# EAGLE design devboard (EAGLE 6.4)
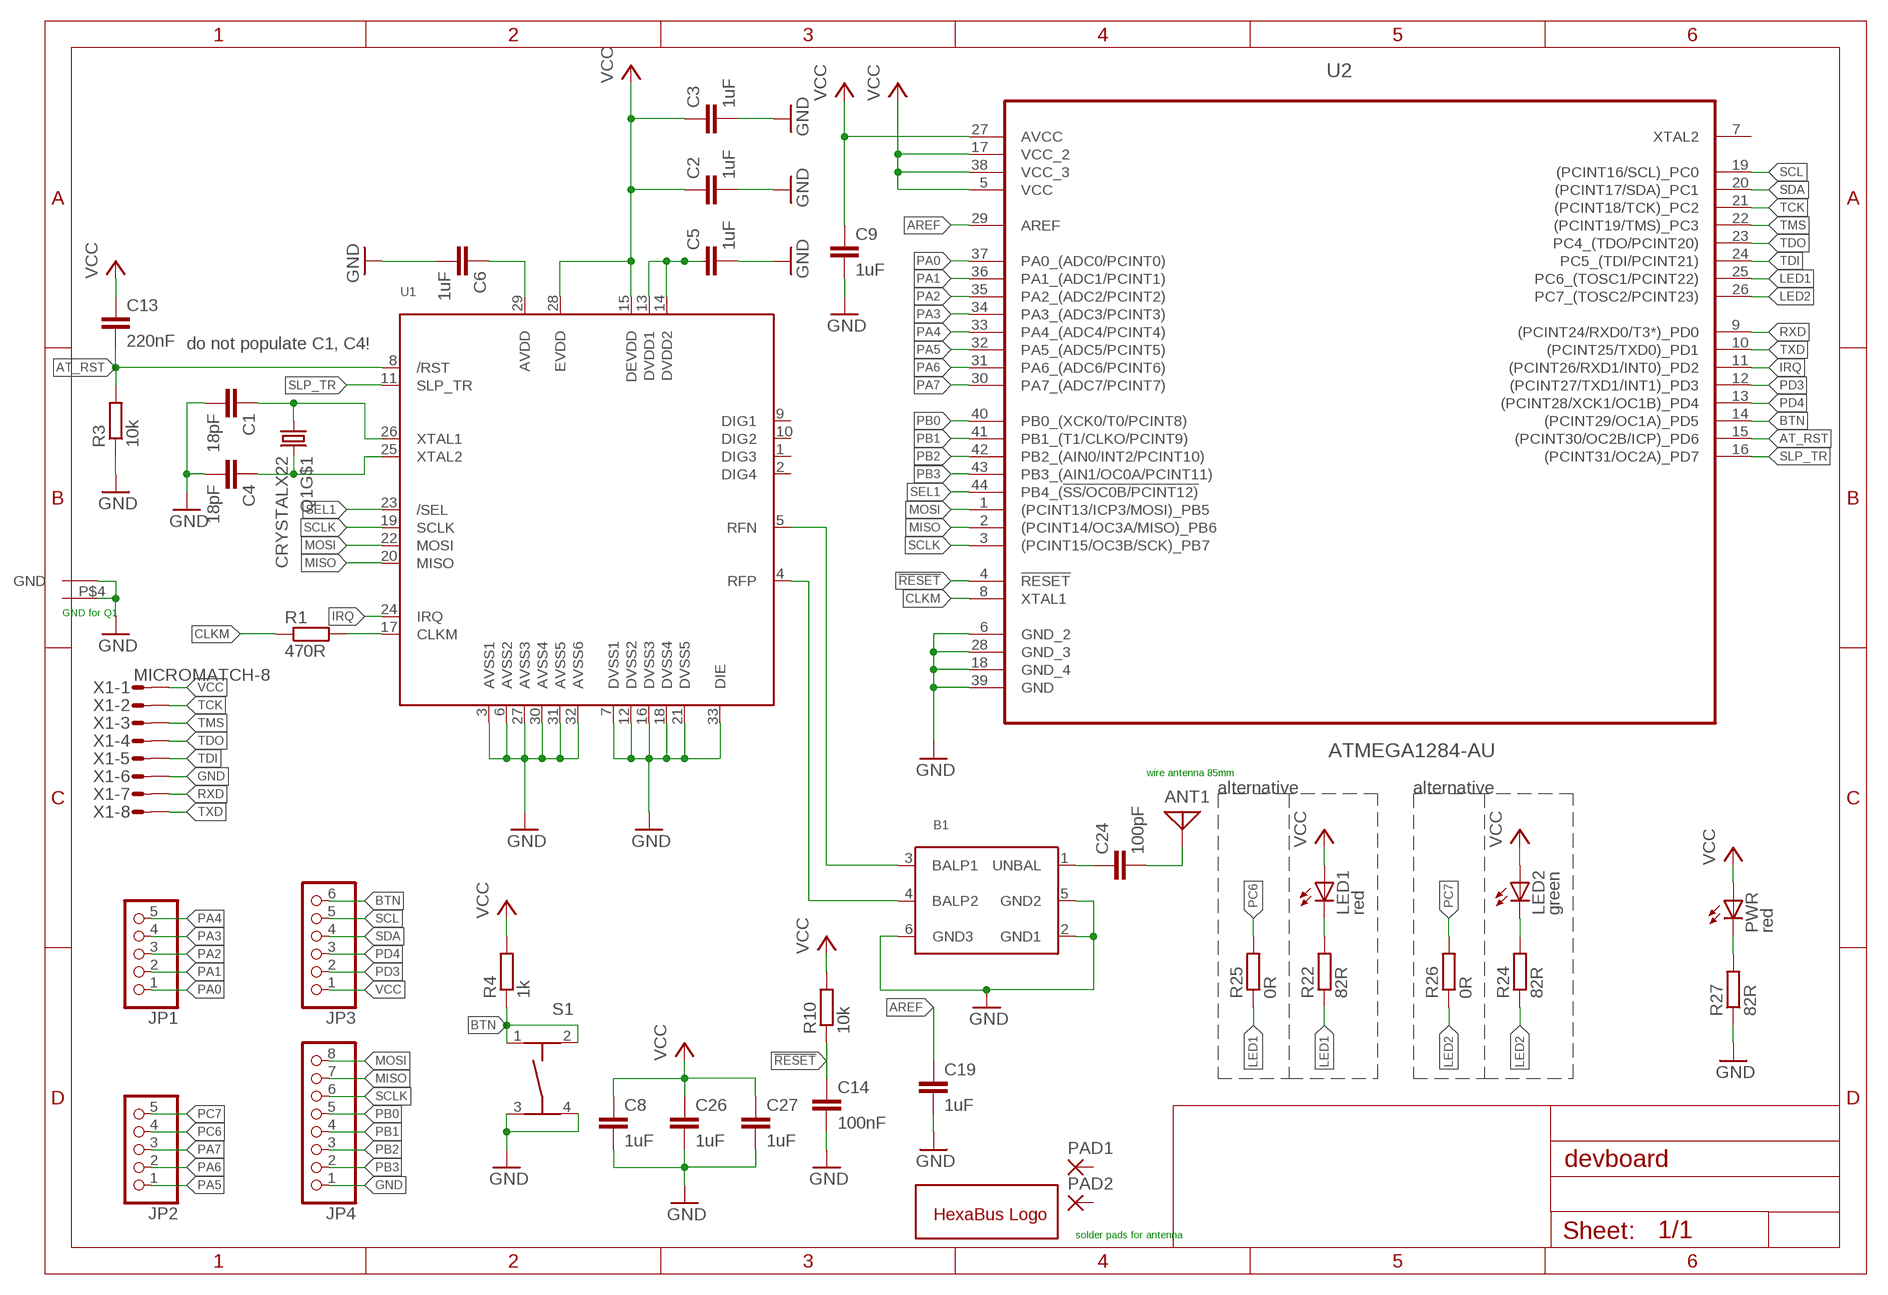
[diagram p0: schematic, sheet 1]

## Parts
ANT1  ANTENNA  [PAD-01]
B1  BALUN+LP  [BALUN0805]
C1  18pF  C-EUC0603  [C0603]
C2  1uF  C-EUC0603  [C0603]
C3  1uF  C-EUC0603  [C0603]
C4  18pF  C-EUC0603  [C0603]
C5  1uF  C-EUC0603  [C0603]
C6  1uF  C-EUC0603  [C0603]
C8  1uF  C-EUC0603  [C0603]
C9  1uF  C-EUC0603  [C0603]
C13  220nF  C-EUC0603  [C0603]
C14  100nF  C-EUC0603  [C0603]
C19  1uF  C-EUC0603  [C0603]
C24  100pF  C-EUC0603  [C0603]
C26  1uF  C-EUC0603  [C0603]
C27  1uF  C-EUC0603  [C0603]
JP1  PINHD-1X5  [1X05]
JP2  PINHD-1X5  [1X05]
JP3  PINHD-1X6  [1X06]
JP4  PINHD-1X8  [1X08]
LED1  red  LEDCHIP-LED0603  [CHIP-LED0603]
LED2  green  LEDCHIP-LED0603  [CHIP-LED0603]
PAD1  SMD2  [SMD1,27-2,54]
PAD2  SMD2  [SMD1,27-2,54]
PWR  red  LEDCHIP-LED0603  [CHIP-LED0603]
Q1  CRYSTALX22  [X22]
R1  470R  R-EU_R0603  [R0603]
R3  10k  R-EU_R0603  [R0603]
R4  1k  R-EU_R0603  [R0603]
R10  10k  R-EU_R0603  [R0603]
R22  82R  R-EU_R0603  [R0603]
R24  82R  R-EU_R0603  [R0603]
R25  0R  R-EU_R0603  [R0603]
R26  0R  R-EU_R0603  [R0603]
R27  82R  R-EU_R0603  [R0603]
S1  TASTER-9314_SMD  [TASTER-9314_SMD]
U1  AT86RF212  [32QN2]
U2  ATMEGA1284-AU  [QFP80P1200X1200X120-44N]
U$1  HEXAKRAKE  [HEXAKRAKE]
X1  MICROMATCH-8  [MICROMATCH-8]

## Nets
!RESET: C14.1 R10.1 U2.4(!RESET)
AREF: C19.1 U2.29(AREF)
AT_RST: C13.2 R3.2 U1.8(/RST) U2.15((PCINT30/OC2B/ICP)_PD6)
BTN: JP3.6 R4.1 S1.1 S1.2 U2.14((PCINT29/OC1A)_PD5)
CLKM: R1.1 U2.8(XTAL1)
GND: B1.2(GND1) B1.5(GND2) B1.6(GND3) C1.2 C2.2 C3.2 C4.2 C5.2 C6.2 C8.2 C9.2 C14.2 C19.2 C26.2 C27.2 JP4.1 Q1.P$2(GND) Q1.P$4(GND1) R3.1 R27.1 S1.3 S1.4 U1.3(AVSS1) U1.6(AVSS2) U1.7(DVSS1) U1.12(DVSS2) U1.16(DVSS3) U1.18(DVSS4) U1.21(DVSS5) U1.27(AVSS3) U1.30(AVSS4) U1.31(AVSS5) U1.32(AVSS6) U1.33(DIE) U2.6(GND_2) U2.18(GND_4) U2.28(GND_3) U2.39(GND) X1.6
IRQ: U1.24(IRQ) U2.11((PCINT26/RXD1/INT0)_PD2)
LED1: R22.1 R25.1 U2.25(PC6_(TOSC1/PCINT22))
LED2: R24.1 R26.1 U2.26(PC7_(TOSC2/PCINT23))
MISO: JP4.7 U1.20(MISO) U2.2((PCINT14/OC3A/MISO)_PB6)
MOSI: JP4.8 U1.22(MOSI) U2.1((PCINT13/ICP3/MOSI)_PB5)
N$1: C6.1 U1.29(AVDD)
N$2: C5.1 U1.13(DVDD1) U1.14(DVDD2)
N$4: LED1.C R22.2
N$5: R1.2 U1.17(CLKM)
N$13: LED2.C R24.2
N$28: B1.3(BALP1) U1.5(RFN)
N$29: B1.4(BALP2) U1.4(RFP)
N$30: C1.1 Q1.P$1 U1.26(XTAL1)
N$31: C4.1 Q1.P$3 U1.25(XTAL2)
N$32: PWR.C R27.2
N$33: B1.1(UNBAL) C24.1
N$34: ANT1.1 C24.2
PA0: JP1.1 U2.37(PA0_(ADC0/PCINT0))
PA1: JP1.2 U2.36(PA1_(ADC1/PCINT1))
PA2: JP1.3 U2.35(PA2_(ADC2/PCINT2))
PA3: JP1.4 U2.34(PA3_(ADC3/PCINT3))
PA4: JP1.5 U2.33(PA4_(ADC4/PCINT4))
PA5: JP2.1 U2.32(PA5_(ADC5/PCINT5))
PA6: JP2.2 U2.31(PA6_(ADC6/PCINT6))
PA7: JP2.3 U2.30(PA7_(ADC7/PCINT7))
PB0: JP4.5 U2.40(PB0_(XCK0/T0/PCINT8))
PB1: JP4.4 U2.41(PB1_(T1/CLKO/PCINT9))
PB2: JP4.3 U2.42(PB2_(AIN0/INT2/PCINT10))
PB3: JP4.2 U2.43(PB3_(AIN1/OC0A/PCINT11))
PC6: JP2.4 R25.2
PC7: JP2.5 R26.2
PD3: JP3.2 U2.12((PCINT27/TXD1/INT1)_PD3)
PD4: JP3.3 U2.13((PCINT28/XCK1/OC1B)_PD4)
RXD: U2.9((PCINT24/RXD0/T3*)_PD0) X1.7
SCL: JP3.5 U2.19((PCINT16/SCL)_PC0)
SCLK: JP4.6 U1.19(SCLK) U2.3((PCINT15/OC3B/SCK)_PB7)
SDA: JP3.4 U2.20((PCINT17/SDA)_PC1)
SEL1: U1.23(/SEL) U2.44(PB4_(!SS/OC0B/PCINT12))
SLP_TR: U1.11(SLP_TR) U2.16((PCINT31/OC2A)_PD7)
TCK: U2.21((PCINT18/TCK)_PC2) X1.2
TDI: U2.24(PC5_(TDI/PCINT21)) X1.5
TDO: U2.23(PC4_(TDO/PCINT20)) X1.4
TMS: U2.22((PCINT19/TMS)_PC3) X1.3
TXD: U2.10((PCINT25/TXD0)_PD1) X1.8
VCC: C2.1 C3.1 C8.1 C9.1 C13.1 C26.1 C27.1 JP3.1 LED1.A LED2.A PWR.A R4.2 R10.2 U1.15(DEVDD) U1.28(EVDD) U2.5(VCC) U2.17(VCC_2) U2.27(AVCC) U2.38(VCC_3) X1.1
Unconnected: PAD1.1(P) PAD2.1(P) U1.1(DIG3) U1.2(DIG4) U1.9(DIG1) U1.10(DIG2) U2.7(XTAL2)

## Notes on the sheet
- do not populate C1, C4!
- GND for Q1
- wire antenna 85mm
- alternative | alternative
- solder pads for antenna

## Library data of the parts
ANT1 = discrete:ANTENNA: Antenna
B1 = microbuilder:BALUN+LP: Balun + Low Pass Filter 0805 863-928 MHz Balun + Low Pass Filter (0805) - Digikey: 712-1473-1-ND
C1-C6 C8 C9 C13 C14 C19 C24 C26 C27 = rcl:C-EU: CAPACITOR, European symbol
JP1 JP2 = pinhead:PINHD-1X5: PIN HEADER
JP3 = pinhead:PINHD-1X6: PIN HEADER
JP4 = pinhead:PINHD-1X8: PIN HEADER
LED1 LED2 PWR = led:LED: LED OSRAM: - CHIPLED LG R971, LG N971, LY N971, LG Q971, LY Q971, LO R971, LY R971 LH N974, LH R974 LS Q976, LO Q976, LY Q976 LO Q996 - Hyper CHIPLED LW Q18S LB Q993, LB Q99A, LB R99A - SideLED LS A670, LO A670, LY A670, LG A670, LP A670 LB A673, LV A673, LT A673, LW A673 LH A674 LY A675 LS A676, LA A676, LO A676, LY A676, LW A676 LS A679, LY A679, LG A679 - Hyper Micro SIDELED® LS Y876, LA Y876, LO Y876, LY Y876 LT Y87S - SmartLED LW L88C, LW L88S LB L89C, LB L89S, LG L890 LS L89K, LO L89K, LY L89K LS L896, LA L896, LO L896, LY L896 - TOPLED LS T670, LO T670, LY T670, LG T670, LP T670 LSG T670, LSP T670, LSY T670, LOP T670, LYG T670 LG T671, LOG T671, LSG T671 LB T673, LV T673, LT T673, LW T673 LH T674 LS T676, LA T676, LO T676, LY T676, LB T676, LH T676, LSB T676, LW T676 LB T67C, LV T67C, LT T67C, LS T67K, LO T67K, LY T67K, LW E67C LS E67B, LA E67B, LO E67B, LY E67B, LB E67C, LV E67C, LT E67C LW T67C LS T679, LY T679, LG T679 LS T770, LO T770, LY T770, LG T770, LP T770 LB T773, LV T773, LT T773, LW T773 LH T774 LS E675, LA E675, LY E675, LS T675 LS T776, LA T776, LO T776, LY T776, LB T776 LHGB T686 LT T68C, LB T68C - Hyper Mini TOPLED® LB M676 - Mini TOPLED Santana® LG M470 LS M47K, LO M47K, LY M47K Source: http://www.osram.convergy.de LUXEON: - LUMILED® LXK2-PW12-R00, LXK2-PW12-S00, LXK2-PW14-U00, LXK2-PW14-V00 LXK2-PM12-R00, LXK2-PM12-S00, LXK2-PM14-U00 LXK2-PE12-Q00, LXK2-PE12-R00, LXK2-PE12-S00, LXK2-PE14-T00, LXK2-PE14-U00 LXK2-PB12-K00, LXK2-PB12-L00, LXK2-PB12-M00, LXK2-PB14-N00, LXK2-PB14-P00, LXK2-PB14-Q00 LXK2-PR12-L00, LXK2-PR12-M00, LXK2-PR14-Q00, LXK2-PR14-R00 LXK2-PD12-Q00, LXK2-PD12-R00, LXK2-PD12-S00 LXK2-PH12-R00, LXK2-PH12-S00 LXK2-PL12-P00, LXK2-PL12-Q00, LXK2-PL12-R00 Source: www.luxeon.com KINGBRIGHT: KA-3528ASYC Source: www.kingbright.com
PAD1 PAD2 = wirepad:SMD2: SMD PAD
Q1 = crystals-new:CRYSTAL
R1 R3 R4 R10 R22 R24-R27 = rcl:R-EU_: RESISTOR, European symbol
S1 = Ergaenzung:TASTER-9314_SMD
U1 = microbuilder:AT86RF212: AT86RF212 - Low-Power SPI-based 700/800/900 MHz Transceiver Digikey: AT86RF212-ZU-ND
U2 = hexabus:ATMEGA1284-AU: MCU, 8BIT, AVR, 128K FLASH, TQFP-44; MPN: ATMEGA1284-AU; OC_FARNELL: 1972064; OC_NEWARK: 68T2551; PACKAGE: TQFP-44; SUPPLIER: ATMEL
U$1 = artwork:HEXAKRAKE
X1 = con-amp-micromatch:MICROMATCH-8: MicroMaTch 8 7-215464-8 / 0-215464-8 Drawing Number C-215464 DDEController.pdf; MF: FARNELL; MPN: 7-215464-8; OC_FARNELL: 3784642; OC_NEWARK: 26H0301

## Board
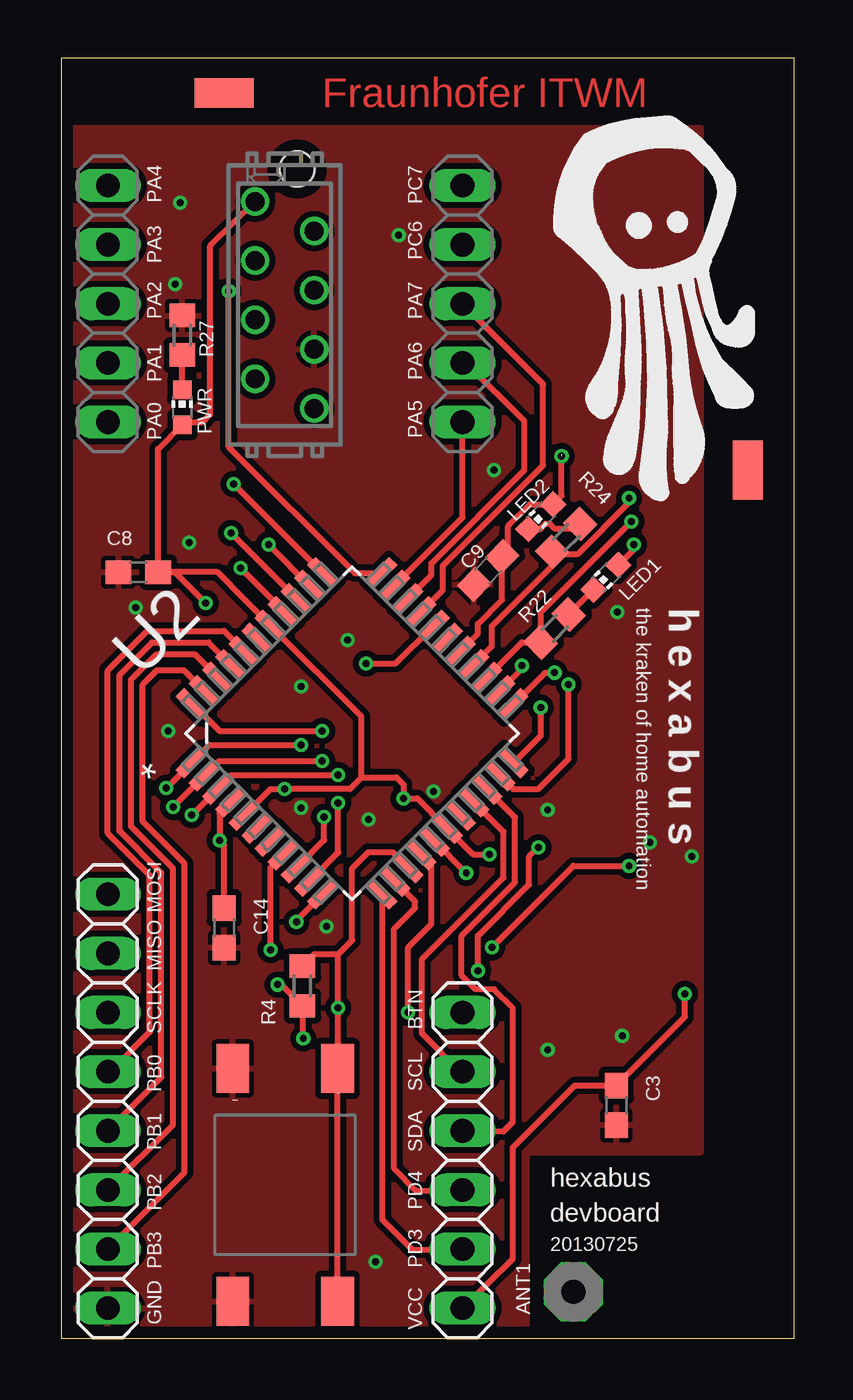
[diagram p1: board, top side]
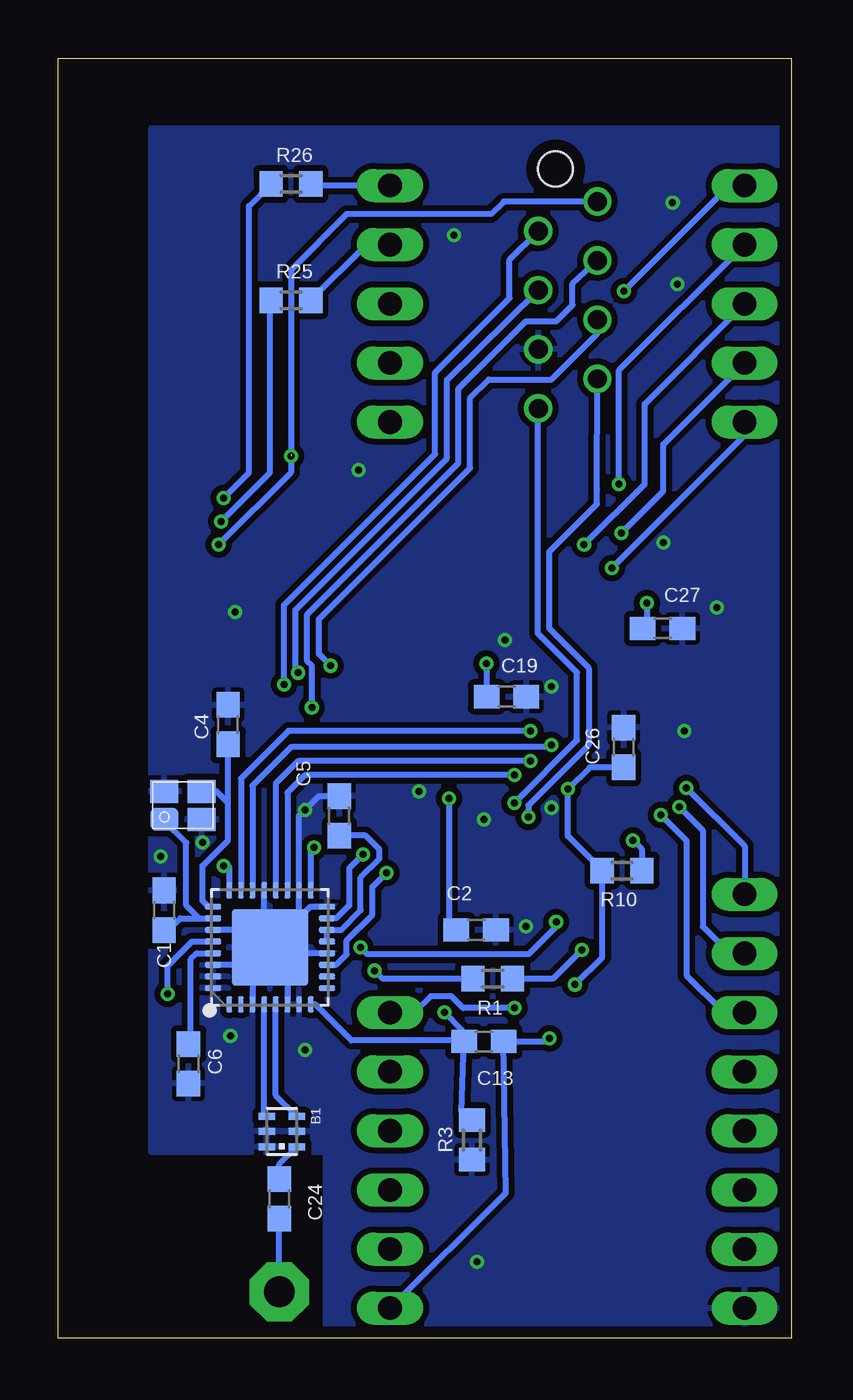
[diagram p2: board, bottom side, seen from below]

Size 31.5 x 55 mm. Coordinates in mm from the lower left corner, seen from the top.
Outline: 0,0 31.5,0 31.5,55 0,55 0,0
Copper layers (1*16): Top 0.035mm / dielectric 1.5mm / Bottom 0.035mm
Design rules "leiton": minimum track width 6mil, minimum drill 0.3mm, track to track 6mil, track to pad 6mil, pad to pad 6mil, via to via 6mil, smd to smd 6mil, copper to edge 20mil, drill to drill 8mil, minimum pad ring 8mil, minimum via ring 6mil, stop-mask expansion 3mil, vias tented up to drill 0mil, thermal gap 8mil
Holes 1.5 mm at 10.13,50.24

### Footprints (pad centres in the part's own frame; a part is rotated, then mirrored left to right if it is on the bottom)
PAD-01 = drill 1.321 pad 2.54 octagon: 1 0,0
BALUN0805 = smd 0.3 x 0.7: 1 0.65,0.65; 2 0,0.65; 3 -0.65,0.65; 4 -0.65,-0.65; 5 0,-0.65; 6 0.65,-0.65
C0603 = smd 1.1 x 1: 1 -0.85,0; 2 0.85,0
1X05 = drill 1.016 long: 1 -5.08,0; 2 -2.54,0; 3 0,0; 4 2.54,0; 5 5.08,0
1X06 = drill 1.016 long: 1 -6.35,0; 2 -3.81,0; 3 -1.27,0; 4 1.27,0; 5 3.81,0; 6 6.35,0
1X08 = drill 1.016 long: 1 -8.89,0; 2 -6.35,0; 3 -3.81,0; 4 -1.27,0; 5 1.27,0; 6 3.81,0; 7 6.35,0; 8 8.89,0
CHIP-LED0603 = smd 0.8 x 0.8: A 0,-0.75; C 0,0.75
SMD1,27-2,54 = smd 1.27 x 2.54: 1 0,0
X22 = smd 1.2 x 1: P$1 -0.8,-0.6; P$2 0.8,-0.6; P$3 0.8,0.6; P$4 -0.8,0.6
R0603 = smd 1 x 1.1: 1 -0.85,0; 2 0.85,0
TASTER-9314_SMD = smd 2.1 x 1.4: 1 -5,2.25; 2 5,2.25; 3 -5,-2.25; 4 5,-2.25
32QN2 = smd 0.7 x 0.25: 1 -2.45,1.75; 2 -2.45,1.25; 3 -2.45,0.75; 4 -2.45,0.25; 5 -2.45,-0.25; 6 -2.45,-0.75; 7 -2.45,-1.25; 8 -2.45,-1.75; 17 2.45,-1.75; 18 2.45,-1.25; 19 2.45,-0.75; 20 2.45,-0.25; 21 2.45,0.25; 22 2.45,0.75; 23 2.45,1.25; 24 2.45,1.75 | smd 0.25 x 0.7: 9 -1.75,-2.45; 10 -1.25,-2.45; 11 -0.75,-2.45; 12 -0.25,-2.45; 13 0.25,-2.45; 14 0.75,-2.45; 15 1.25,-2.45; 16 1.75,-2.45; 25 1.75,2.45; 26 1.25,2.45; 27 0.75,2.45; 28 0.25,2.45; 29 -0.25,2.45; 30 -0.75,2.45; 31 -1.25,2.45; 32 -1.75,2.45 | smd 3.3 x 3.3: 33 0,0
QFP80P1200X1200X120-44N = smd 1.473 x 0.508: 1 -5.74,3.988; 2 -5.74,3.2; 3 -5.74,2.388; 4 -5.74,1.6; 5 -5.74,0.787; 6 -5.74,0; 7 -5.74,-0.787; 8 -5.74,-1.6; 9 -5.74,-2.388; 10 -5.74,-3.2; 11 -5.74,-3.988; 23 5.74,-3.988; 24 5.74,-3.2; 25 5.74,-2.388; 26 5.74,-1.6; 27 5.74,-0.787; 28 5.74,0; 29 5.74,0.787; 30 5.74,1.6; 31 5.74,2.388; 32 5.74,3.2; 33 5.74,3.988 | smd 0.508 x 1.473: 12 -3.988,-5.74; 13 -3.2,-5.74; 14 -2.388,-5.74; 15 -1.6,-5.74; 16 -0.787,-5.74; 17 0,-5.74; 18 0.787,-5.74; 19 1.6,-5.74; 20 2.388,-5.74; 21 3.2,-5.74; 22 3.988,-5.74; 34 3.988,5.74; 35 3.2,5.74; 36 2.388,5.74; 37 1.6,5.74; 38 0.787,5.74; 39 0,5.74; 40 -0.787,5.74; 41 -1.6,5.74; 42 -2.388,5.74; 43 -3.2,5.74; 44 -3.988,5.74
MICROMATCH-8 = drill 0.813: 1 4.445,1.27; 2 3.175,-1.27; 3 1.905,1.27; 4 0.635,-1.27; 5 -0.635,1.27; 6 -1.905,-1.27; 7 -3.175,1.27; 8 -4.445,-1.27

### Placement (x,y rotation side)
ANT1  22,2 0 top
B1  21.89,8.89 270 bottom
C1  26.94,18.4 90 bottom
C2  13.54,17.55 0 bottom
C3  23.85,10.02 270 top
C4  24.2,26.37 90 bottom
C5  19.42,22.45 90 bottom
C6  25.9,11.8 270 bottom
C8  3.31,32.92 180 top
C9  18.34,32.99 225 top
C13  13.21,12.76 180 bottom
C14  7,17.64 270 top
C19  12.23,27.57 0 bottom
C24  22,6 270 bottom
C26  7.2,25.39 90 bottom
C27  5.53,30.5 0 bottom
JP1  2,44.45 90 top
JP2  17.24,44.45 90 top
JP3  17.24,7.65 90 top
JP4  2,10.19 90 top
LED1  23.4,32.7 135 top
LED2  20.6,35.3 135 top
PAD1  7,53.5 90 top
PAD2  29.5,37.3 0 top
PWR  5.2,40 0 top
Q1  26.14,22.9 0 bottom
R1  12.83,15.45 180 bottom
R3  13.72,8.53 90 bottom
R4  10.36,15.14 270 top
R10  7.27,20.1 180 bottom
R22  21.2,30.5 45 top
R24  21.7,34.4 45 top
R25  21.5,44.6 0 bottom
R26  21.5,49.6 0 bottom
R27  5.2,43.1 270 top
S1  9.62,6.6 270 top
U1  22.4,16.8 90 bottom
U2  12.5,26 45 top
U$1  21.2,36.1 0 top
X1  9.6,44.4 90 top

### Tracks (layer width: path | path; a pad name or v marks a point on that pad's centre or on a via)
!RESET  (via drill 0.3)
  Top 0.254: C14.1 7,21.2 v6.8,21.4 6.8,22.56 U2.4
  Bottom 0.254: v6.8,21.4 6.42,21.02 R10.1
AREF  (via drill 0.3)
  Top 0.254: v13.1,29 14.37,29 15.98,30.62 U2.29
  Bottom 0.254: C19.1 13.08,28.98
  Bottom 0.406: 13.08,28.98 v13.1,29
AT_RST  (via drill 0.3)
  Top 0.254: v14.9,14 14.9,16.8 15.9,17.8 15.9,20.34 U2.15 | U2.15
  Bottom 0.254: R3.2 14.16,9.74 C13.2 | U1.8 20.45,14.35 18.9,12.8 14.2,12.8 C13.2 | C13.2 14.16,13.26 v14.9,14
BTN  (via drill 0.3)
  Top 0.254: S1.2 S1.1 11.9,11.63 v11.9,14.2 11.9,16.5 | 11.9,16.5 12.5,17.1 12.5,20.2 13.2,20.9 14.22,20.9 U2.14 | R4.1 10.87,16.5 11.9,16.5
  Bottom 0.254: v11.9,14.2 14.1,14.2 14.6,14.7 15.5,14.7 16.2,14 JP3.6
CLKM  (via drill 0.3)
  Top 0.254: v9,16.7 9,20.24 U2.8 | U2.8
  Bottom 0.254: v9,16.7 10.25,15.45 R1.1
GND  (via drill 0.3)
  Bottom 0.254: U1.33 22.75,16.8 | U1.33 22.05,16.8 | U1.33 22.4,15.74 | 21.9,16.8 U1.33 | 21.9,16.8 21.34,16.8 | U1.21 22.65,17.05 U1.33 | U1.33 21.15,18.05 U1.18 21.15,22.45 v20.9,22.7 20.3,23.3 C5.2 | U1.16 20.65,18.55 U1.33 | U1.12 21.65,16.55 21.9,16.8 | 23.15,16.05 U1.3 | 23.15,16.05 U1.30 | U1.33 23.15,16.05 | U1.6 21.65,16.05 U1.33 | U1.27 23.15,17.55 U1.33
  other vias: 4.9,45.3 5.1,48.8 14.5,47.4 23.9,31.2 12.3,30 3.2,31.4 10.3,28 20.9,12.4 25.3,21.3 27.1,20.7 16,23.5 4.6,26.1 5.5,34.2 13.2,22.3 11.4,17.7 18.6,37.3 13.5,3.3 10.3,22.8 24.1,13
  pour Top (isolate 0.254): 0,0 20,0 20,8 27.5,8 27.5,52 0,52
  pour Bottom (isolate 0.254): 0,0 20,0 20,8 27.5,8 27.5,52 0,52
IRQ  (via drill 0.3)
  Top 0.254: v24.4,20.3 22,20.3 v18.5,16.8 | v10.1,17.9 10.1,17.96 U2.11
  Bottom 0.254: v10.1,17.9 10.1,17.7 11.3,16.5 18.2,16.5 v18.5,16.8 | U1.24 24.15,20.25 v24.4,20.3
LED1  (via drill 0.3)
  Top 0.254: v24.5,35.1 20.6,31.2 20.6,30.1 R22.1 19.79,29.9 18.27,28.37 U2.25
  Bottom 0.254: R25.1 22.4,44.55 22.4,37.2 v24.5,35.1
LED2  (via drill 0.3)
  Top 0.254: v24.4,36.1 24.4,35.9 22.2,33.7 21.2,33.7 R24.1 21.2,33.3 18.5,30.6 18.5,29.74 U2.26 | U2.26
  Bottom 0.254: R26.1 23.3,48.65 23.3,37.2 v24.4,36.1
MISO  (via drill 0.3)
  Top 0.254: v11.2,24.8 6.77,24.8 U2.2 | U2.2 | U2.2 v4.8,22.83 v4.8,22.82
  Bottom 0.254: U1.20 22.15,23.85 21.2,24.8 v11.2,24.8 | v4.8,22.82 3.8,21.82 3.8,17.7 2.64,16.54 JP4.7
MOSI  (via drill 0.3)
  Top 0.254: v10.3,25.5 6.34,25.5 5.62,24.78 U2.1 4.52,23.66 v4.5,23.66
  Bottom 0.254: U1.22 23.15,23.75 21.5,25.4 10.4,25.4 v10.3,25.5 | v4.5,23.66 2,21.16 JP4.8
N$1
  Bottom 0.254: U1.29 25.55,16.55 25.8,16.3 25.8,12.75 C6.1
N$2
  Bottom 0.254: C5.1 18.3,21.6 17.7,21 17.7,20.6 18.5,19.8 18.5,18.4 19.35,17.55 U1.14 U1.13
N$4
  Top 0.254: R22.2 LED1.C
N$5  (via drill 0.3)
  Top 0.254: v17.9,15.8 17.9,17.3 20.1,19.5 20.1,20.7 v20.5,21.1
  Bottom 0.254: 13.6,15.53 R1.2 17.55,15.45 v17.9,15.8 | U1.17 20.65,20.95 v20.5,21.1
N$13
  Top 0.254: 22.27,34.77 R24.2 22.1,34.8 21.2,34.8 21,35 20.8,35 20.57,34.77 LED2.C
N$28
  Bottom 0.254: U1.5 22.15,10.45 B1.3
N$29
  Bottom 0.254: U1.4 22.65,9.65 B1.4
N$30
  Bottom 0.254: 25.45,18.05 U1.26 | 26.8,22.3 Q1.P$1 26.94,22.24 26,21.3 26,18.6 25.45,18.05 | 25.45,18.05 26.24,18.05 26.74,17.55 C1.1
N$31
  Bottom 0.254: U1.25 25.05,18.55 25.3,18.8 25.3,20.3 24.2,21.4 24.2,23 | 24.2,23 C4.1 | Q1.P$3 24.7,23.5 24.2,23
N$32
  Top 0.254: PWR.C R27.2
N$33
  Bottom 0.254: C24.1 22,7.48 B1.1
N$34
  Bottom 0.254: ANT1.1 C24.2
PA0  (via drill 0.3)
  Top 0.254: v7.7,33.1 9.57,31.23 U2.37
  Bottom 0.254: v7.7,33.1 2,38.8 JP1.1
PA1  (via drill 0.3)
  Top 0.254: v7.3,34.6 10.13,31.77 U2.36
  Bottom 0.254: v7.3,34.6 5.5,36.4 5.5,38.41 JP1.2
PA2  (via drill 0.3)
  Top 0.254: v8.9,34.1 10.68,32.32 U2.35
  Bottom 0.254: v8.9,34.1 6.3,36.7 6.3,40.15 JP1.3
PA3  (via drill 0.3)
  Top 0.254: v7.4,36.7 11.22,32.88 U2.34
  Bottom 0.254: JP1.4 7.4,41.59 v7.4,36.7
PA4  (via drill 0.3)
  Top 0.254: v7.2,45 7.2,38.3 12.62,32.88 U2.33
  Bottom 0.254: v7.2,45 2.67,49.53 JP1.5
PA5
  Top 0.254: JP2.1 17.24,35.27 U2.32
PA6
  Top 0.254: JP2.2 17.39,41.91 19.9,39.4 19.9,37.3 15.9,33.3 15.9,32.79 14.87,31.77 U2.31
PA7
  Top 0.254: JP2.3 20.7,40.99 20.7,37.5 16.4,33.2 16.4,32.16 U2.30 | U2.30
PB0
  Top 0.254: JP4.5 2.1,11.46 3.8,13.16 3.8,19.9 2,21.7 2,28.7 3.7,30.4 6.99,30.4 U2.40
PB1
  Top 0.254: 6.34,29.9 3.9,29.9 2.5,28.5 2.5,21.8 4.3,20 4.3,11.22 JP4.4 | U2.41 6.34,29.9 | 6.34,29.9
PB2
  Top 0.254: JP4.3 4.8,9.18 4.8,20.2 3,22 3,28.3 4.1,29.4 5.72,29.4 U2.42
PB3
  Top 0.254: JP4.2 5.3,7.14 5.3,20.4 3.5,22.2 3.5,28.1 4.1,28.7 5.28,28.7 U2.43
PC6
  Bottom 0.254: JP2.4 18.26,46.99 R25.2
PC7
  Bottom 0.254: JP2.5 20.58,49.53 R26.2
PD3
  Top 0.254: JP3.2 15.09,3.81 13.8,5.1 13.8,19.04 13.74,19.1 U2.12
PD4
  Top 0.254: JP3.3 15.25,6.35 14.3,7.3 14.3,17.6 15.2,18.5 15.2,18.77 | U2.13 15.2,18.77 | 15.2,18.77
RXD  (via drill 0.3)
  Top 0.254: v11.3,22.4 11.3,21.41 10.15,20.25 U2.9
  Bottom 0.254: X1.7 8.35,36.45 8.35,35.85 10.4,33.8 10.4,30.5 8.7,28.8 8.7,25.5 11.3,22.9 v11.3,22.4
SCL
  Top 0.254: JP3.5 17.14,11.46 15.5,13.1 15.5,16.3 19,19.8 19,21.76 U2.19
SCLK  (via drill 0.3)
  Top 0.254: v11.9,24.2 7.31,24.2 6.75,23.65 U2.3 5.62,22.49 v5.6,22.49
  Bottom 0.254: U1.19 21.65,23.45 20.9,24.2 v11.9,24.2 | v5.6,22.49 4.5,21.39 4.5,15.6 2.9,14 JP4.6
SDA
  Top 0.254: JP3.4 18.99,8.89 19.4,9.3 19.4,14.2 18.6,15 17.8,15 17.2,15.6 17.2,17.3 19.5,19.6 19.5,22.39 19.48,22.39 U2.20
SEL1  (via drill 0.3)
  Top 0.254: v11.2,26.1 6.8,26.1 5.66,27.24 U2.44
  Bottom 0.254: U1.23 23.65,24.05 21.6,26.1 v11.2,26.1
SLP_TR  (via drill 0.3)
  Top 0.254: v17.4,20 16.02,21.38 U2.16
  Bottom 0.254: v17.4,20 18,19.4 18,18.2 19.1,17.1 19.1,16.5 19.55,16.05 U1.11
TCK  (via drill 0.3)
  Top 0.254: v21.8,28.1 21.8,24.9 20.5,23.6 19.43,23.6 U2.21
  Bottom 0.254: v21.8,28.1 21.8,31.5 15.3,38 15.3,41.5 12.1,44.7 12.1,46.34 X1.2
TDI  (via drill 0.3)
  Top 0.254: 19.8,28.77 v19.8,28.9 19.8,28.77 | U2.24 19.8,28.77
  Bottom 0.254: X1.5 8.35,43.15 10.3,41.2 13,41.2 13.8,40.4 13.8,37.4 20.3,30.9 20.3,29.4 v19.8,28.9
TDO  (via drill 0.3)
  Top 0.254: v21.2,28.6 20.8,28.6 19.44,27.24 U2.23
  Bottom 0.254: X1.4 14.8,41.17 14.8,37.8 21.3,31.3 21.3,28.7 v21.2,28.6
TMS  (via drill 0.3)
  Top 0.254: v20.6,27.1 20.6,25.9 19.46,24.76 U2.22
  Bottom 0.254: 20.5,27.2 v20.6,27.1 20.6,28.9 20.8,29.1 20.8,31.1 14.3,37.6 14.3,40.8 11.4,43.7 10.1,43.7 9.4,44.4 9.4,45.3 X1.3
TXD  (via drill 0.3)
  Top 0.254: v11.9,23 11.9,20.88 U2.10 | U2.10
  Bottom 0.254: X1.8 10.89,39.94 10.89,30.29 9.2,28.6 9.2,25.7 v11.9,23
VCC  (via drill 0.3)  (1 unrouted)
  Top 0.254: X1.1 6.4,46.95 6.4,39.7 6.07,39.37 5.08,39.37 PWR.A 4.16,38.21 C8.1 | C8.1 6.71,32.92 U2.38 12.9,26.71 12.9,24.1 | v6.2,31.6 4.88,32.92 C8.1 | 12.9,24.1 14.4,24.1 14.7,23.8 v14.7,23.2 15.3,23.2 U2.17 | v9.3,15.2 9.45,15.2 R4.2 10.4,14.25 v10.4,12.9 | JP3.1 19.4,3.43 19.4,8.2 22.07,10.87 C3.1 26.8,13.82 v26.8,14.8 | 17.7,20.8 v18.4,20.8 | 23.8,33.36 LED1.A 24.6,33.9 v24.6,34.1 | v21.5,37.9 21.5,36.2 LED2.A 20.13,35.83 19.2,34.9 19.2,33.85 C9.1 18.94,31.74 17.9,30.7 17.9,30.27 17.13,29.5 U2.27 | 12.9,24.1 12.4,23.6 v9.6,23.6 8.99,23.6 U2.5 | U2.17 17.7,20.8 | 17.7,20.8 | U2.17
  Bottom 0.254: C27.1 6.2,30.68 v6.2,31.6 | R10.2 8.1,20.08 | 9.4,15.1 v9.3,15.2 8.12,16.38 R10.2 | v10.4,12.9 10.54,12.76 C13.1 12.26,6.25 JP3.1 | U1.15 19.55,18.05 19,18.6 19,20.2 v18.4,20.8 | U1.28 25.75,17.05 26.8,16 v26.8,14.8 | X1.1 12.36,48.84 12.9,48.3 19.1,48.3 21.5,45.9 21.5,38 | v24.6,34.1 21.5,37.2 v21.5,37.9 | C2.1 14.7,17.55 v14.7,23.2 | R10.2 9.6,21.58 v9.6,23.6 8.66,24.54 C26.1

### Text on the board
Top: Fraunhofer ITWM
tPlace: PC7 | PA4 | PC6 | PA3 | PA7 | PA2 | PA6 | PA1 | PA5 | PA0 | the kraken of home automation | h e x a b u s | MOSI | MISO | BTN | SCLK | SCL | PB0 | SDA | PB1 | PD4 | PB2 | hexabus | PD3 | devboard | 20130725 | PB3 | VCC | GND